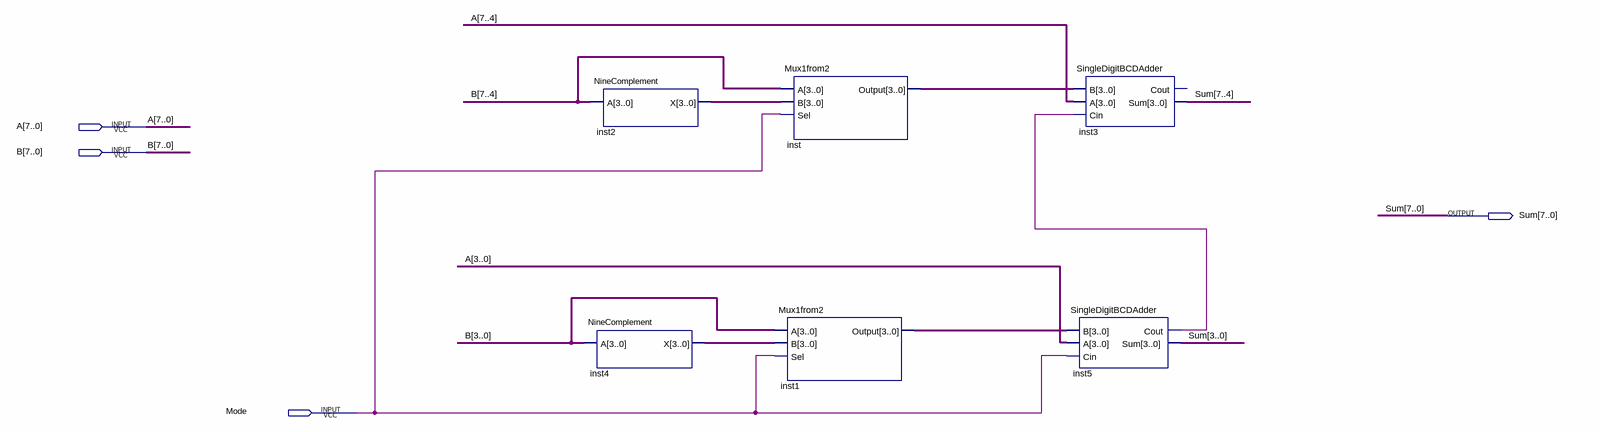
[diagram p0: schematic sheet]
// Quartus schematic DoubleDigitBCDAdderSubtractort.bdf as structural Verilog: 6 symbols, 4 pins
module DoubleDigitBCDAdderSubtractort (
  input  [7:0] A,
  input  [7:0] B,
  input  Mode,
  output [7:0] Sum
);

  wire inst5_cout;
  wire [3:0] inst1_output, inst2_x, inst4_x, inst_output;

  NineComplement inst2 (.A(B[7:4]), .X(inst2_x));
  NineComplement inst4 (.A(B[3:0]), .X(inst4_x));
  Mux1from2 inst (.A(B[7:4]), .B(inst2_x), .Sel(Mode), .Output(inst_output));
  Mux1from2 inst1 (.A(B[3:0]), .B(inst4_x), .Sel(Mode), .Output(inst1_output));
  SingleDigitBCDAdder inst3 (.B(inst_output), .A(A[7:4]), .Cin(inst5_cout), .Sum(Sum[7:4]));  // open: Cout
  SingleDigitBCDAdder inst5 (.B(inst1_output), .A(A[3:0]), .Cin(Mode), .Cout(inst5_cout), .Sum(Sum[3:0]));
endmodule
